# EAGLE design BATT_DCDC_REVISION (EAGLE 9.6.2)
COMPANY: ADAFRUIT INDUSTRIES; DRAWN: KTOWN; REV: B
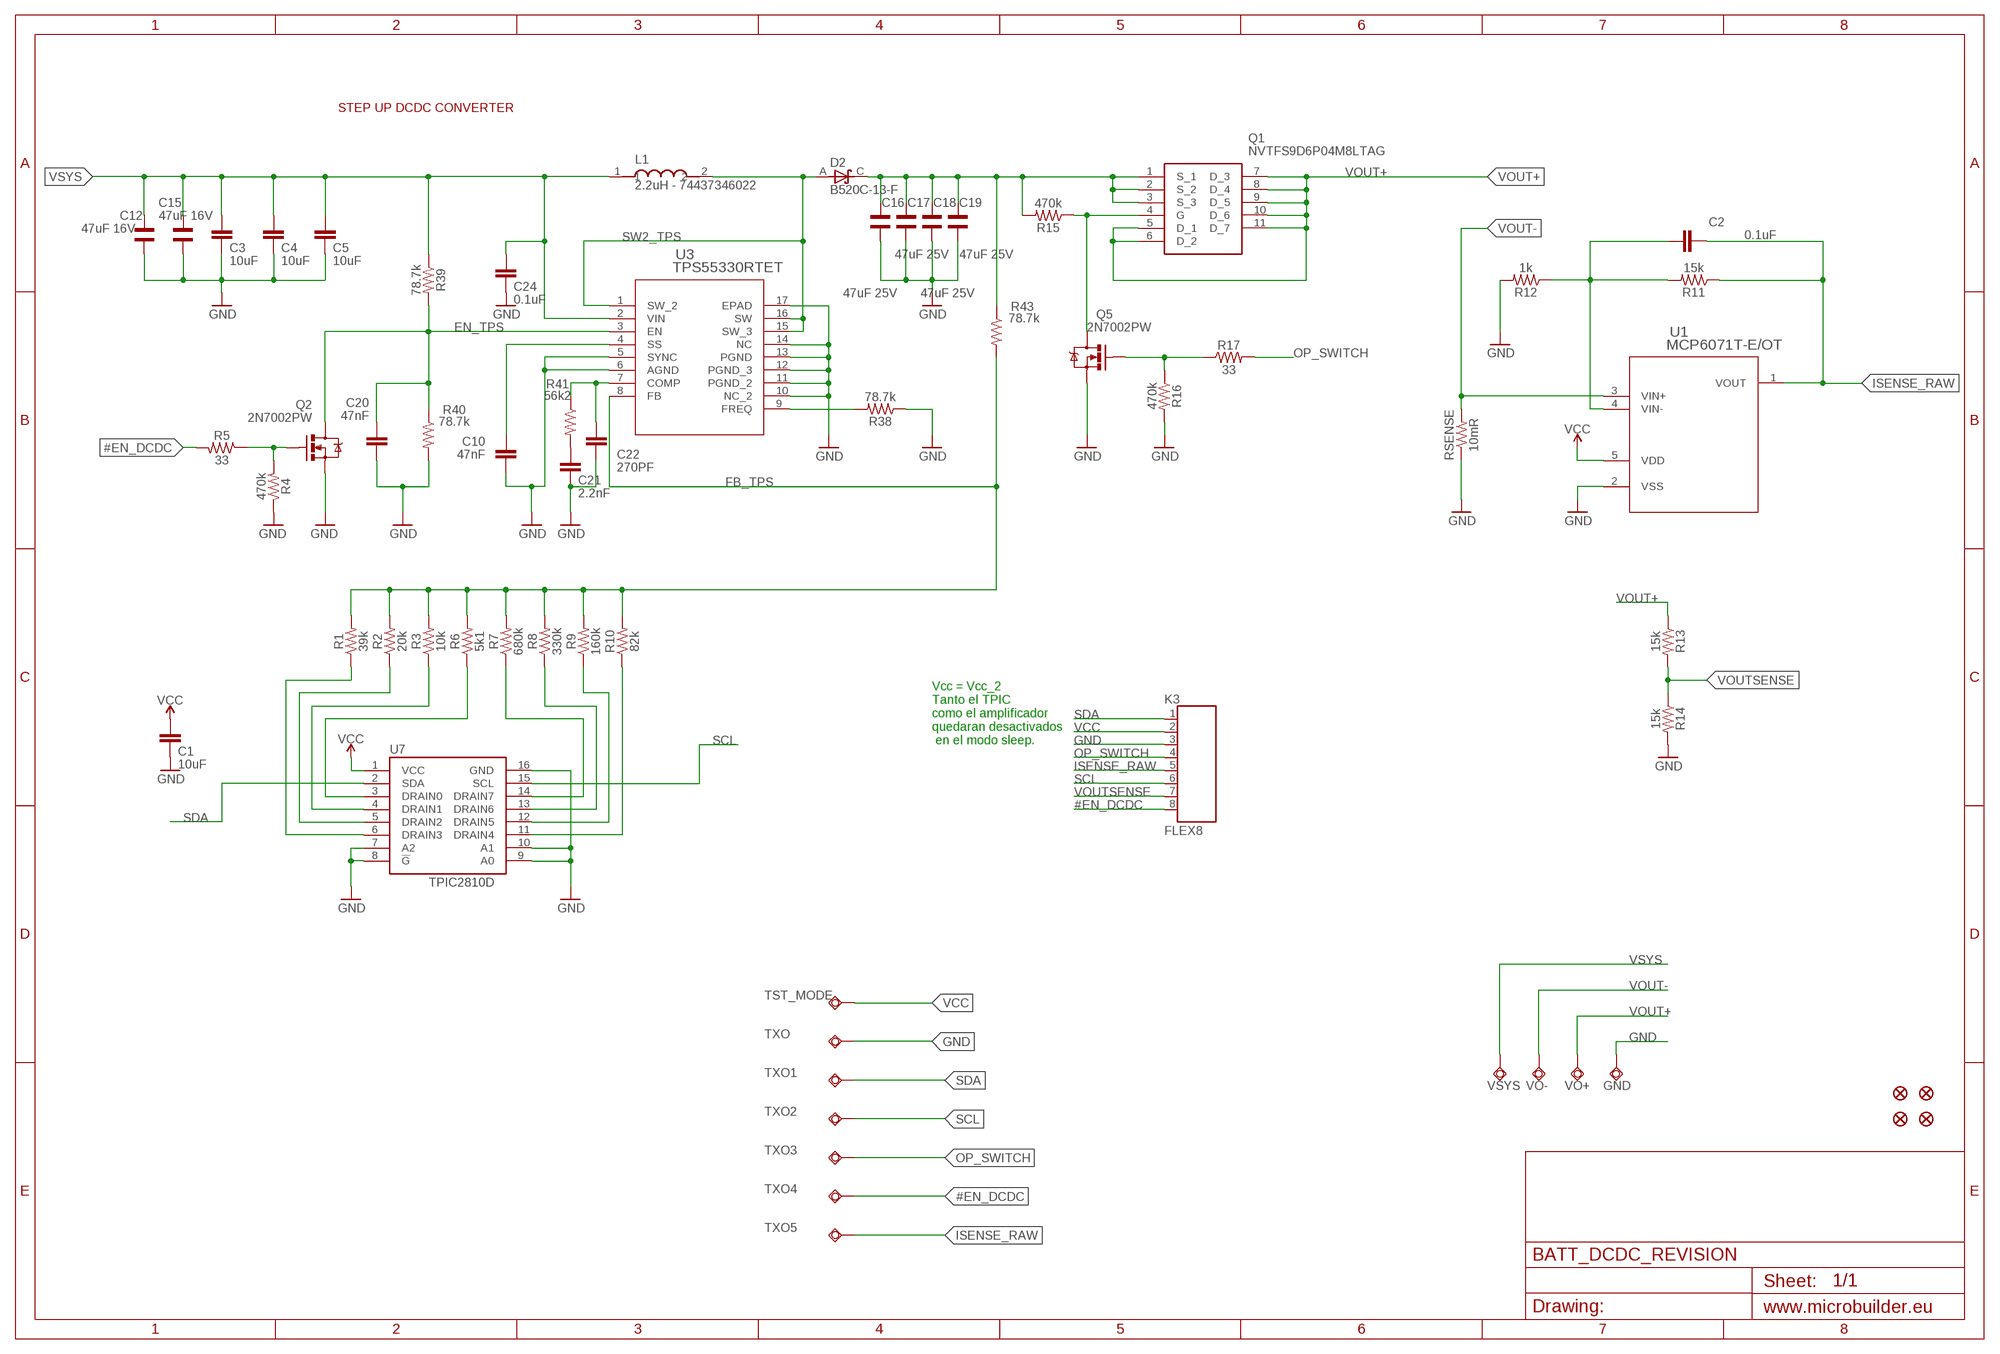
[diagram p0: schematic, sheet 1]

## Parts
C1  10uF  10UF-0805-10V-10%  [0805]
C2  0.1uF  0.1UF-0603-25V-(+80/-20%)  [0603]
C3  10uF  10UF-0805-10V-10%  [0805]
C4  10uF  10UF-0805-10V-10%  [0805]
C5  10uF  10UF-0805-10V-10%  [0805]
C10  47nF  47NF-0603-25V-5%  [0603]
C12  47uF 16V  WCAP-CSGP_1210_885012109003  [WCAP-CSGP_1210]
C15  47uF 16V  WCAP-CSGP_1210_885012109003  [WCAP-CSGP_1210]
C16  47uF 25V  WCAP-CSGP_1210_885012109003  [WCAP-CSGP_1210]
C17  47uF 25V  WCAP-CSGP_1210_885012109003  [WCAP-CSGP_1210]
C18  47uF 25V  WCAP-CSGP_1210_885012109003  [WCAP-CSGP_1210]
C19  47uF 25V  WCAP-CSGP_1210_885012109003  [WCAP-CSGP_1210]
C20  47nF  47NF-0603-25V-5%  [0603]
C21  2.2nF  2.2NF/2200PF-0603-50V-10%  [0603]
C22  270PF  270PF-0603-50V-5%  [0603]
C24  0.1uF  0.1UF-0603-25V-(+80/-20%)  [0603]
D2  B520C-13-F  [DIOM7959X250N]
GND  TESTPAD_TPSQTP15SQ  [TESTPAD_TP15SQ]
K3  FLEX8  [FLEX8]
L1  2.2uH - 74437346022  74437349100  [INDM7366X500]
Q1  NVTFS9D6P04M8LTAG  [NVTFS5124PLTWG]
Q2  2N7002PW  MOSFET-NCHANNEL2N7002PW  [SOT323]
Q5  2N7002PW  MOSFET-NCHANNEL2N7002PW  [SOT323]
R1  39k  RESISTOR0402  [0402]
R2  20k  RESISTOR0402  [0402]
R3  10k  RESISTOR0402  [0402]
R4  470k  RESISTOR0402  [0402]
R5  33  RESISTOR0402  [0402]
R6  5k1  RESISTOR0402  [0402]
R7  680k  RESISTOR0402  [0402]
R8  330k  RESISTOR0402  [0402]
R9  160k  RESISTOR0402  [0402]
R10  82k  RESISTOR0402  [0402]
R11  15k  RESISTOR0402  [0402]
R12  1k  RESISTOR0402  [0402]
R13  15k  RESISTOR0402  [0402]
R14  15k  RESISTOR0402  [0402]
R15  470k  RESISTOR0402  [0402]
R16  470k  RESISTOR0402  [0402]
R17  33  RESISTOR0402  [0402]
R38  78.7k  RESISTOR0402  [0402]
R39  78.7k  RESISTOR0402  [0402]
R40  78.7k  RESISTOR0402  [0402]
R41  56k2  RESISTOR0402  [0402]
R43  78.7k  RESISTOR0402  [0402]
RSENSE  10mR  RESISTOR0603  [0603]
TST_MODE  TESTPAD_TPSQB1,27  [TESTPAD_B1,27]
TXO  TESTPAD_TPSQB1,27  [TESTPAD_B1,27]
TXO1  TESTPAD_TPSQB1,27  [TESTPAD_B1,27]
TXO2  TESTPAD_TPSQB1,27  [TESTPAD_B1,27]
TXO3  TESTPAD_TPSQB1,27  [TESTPAD_B1,27]
TXO4  TESTPAD_TPSQB1,27  [TESTPAD_B1,27]
TXO5  TESTPAD_TPSQB1,27  [TESTPAD_B1,27]
U1  MCP6071T-E/OT  [SOT-23-5_MC_MCH]
U3  TPS55330RTET  [RTE16_1P66X1P66_TEX]
U7  TPIC2810D  [SO16]
U$1  FIDUCIAL""  [FIDUCIAL_1MM]
U$2  FIDUCIAL""  [FIDUCIAL_1MM]
U$34  FIDUCIAL""  [FIDUCIAL_1MM]
U$35  FIDUCIAL""  [FIDUCIAL_1MM]
VO+  TESTPAD_TPSQTP15SQ  [TESTPAD_TP15SQ]
VO-  TESTPAD_TPSQTP15SQ  [TESTPAD_TP15SQ]
VSYS  TESTPAD_TPSQTP15SQ  [TESTPAD_TP15SQ]

## Nets
#EN_DCDC: K3.8 R5.2 TXO4.TP
COMP_TPS: C22.2 R41.1 U3.7(COMP)
EN_TPS: C20.1 Q2.3(D) R39.2 R40.1 U3.3(EN)
FB_TPS: R1.2 R2.2 R3.2 R6.2 R7.2 R8.2 R9.2 R10.2 R43.2 U3.8(FB)
FREQ_TPS: R38.2 U3.9(FREQ)
GND: C1.1 C3.1 C4.1 C5.1 C10.2 C12.1 C15.1 C16.1 C17.1 C18.1 C19.1 C20.2 C21.1 C22.1 C24.1 GND.TP K3.3 Q2.2(S) Q5.2(S) R4.1 R12.2 R14.2 R16.2 R38.1 R40.2 RSENSE.1 TXO.TP U1.2(VSS) U3.5(SYNC) U3.6(AGND) U3.10(NC_2) U3.11(PGND_2) U3.12(PGND_3) U3.13(PGND) U3.14(NC) U3.17(EPAD) U7.7(A2) U7.8(!G) U7.9(A0) U7.10(A1) U7.16(GND)
ISENSE_RAW: C2.1 K3.5 R11.1 TXO5.TP U1.1(VOUT)
N$1: C2.2 R11.2 R12.1 U1.4(VIN-)
N$2: R1.1 U7.6(DRAIN3)
N$3: R2.1 U7.5(DRAIN2)
N$4: Q2.1(G) R4.2 R5.1
N$5: R3.1 U7.4(DRAIN1)
N$6: R6.1 U7.3(DRAIN0)
N$7: R7.1 U7.14(DRAIN7)
N$8: Q1.4(G) Q5.3(D) R15.1
N$9: R8.1 U7.13(DRAIN6)
N$10: R9.1 U7.12(DRAIN5)
N$11: R10.1 U7.11(DRAIN4)
N$13: Q5.1(G) R16.1 R17.1
N$35: C10.1 U3.4(SS)
N$43: C21.2 R41.2
OP_SWITCH: K3.4 R17.2 TXO3.TP
SCL: K3.6 TXO2.TP U7.15(SCL)
SDA: K3.1 TXO1.TP U7.2(SDA)
SW2_TPS: D2.A L1.2 U3.1(SW_2) U3.15(SW_3) U3.16(SW)
VCC: C1.2 K3.2 TST_MODE.TP U1.5(VDD) U7.1(VCC)
VOUT+: Q1.5(D_1) Q1.6(D_2) Q1.7(D_3) Q1.8(D_4) Q1.9(D_5) Q1.10(D_6) Q1.11(D_7) R13.1 VO+.TP
VOUT-: RSENSE.2 U1.3(VIN+) VO-.TP
VOUTSENSE: K3.7 R13.2 R14.1
VSOURCE: C16.2 C17.2 C18.2 C19.2 D2.C Q1.1(S_1) Q1.2(S_2) Q1.3(S_3) R15.2 R43.1
VSYS: C3.2 C4.2 C5.2 C12.2 C15.2 C24.2 L1.1 R39.1 U3.2(VIN) VSYS.TP

## Notes on the sheet
- STEP UP DCDC CONVERTER
- Vcc = Vcc_2
  Tanto el TPIC 
  como el amplificador
  quedaran desactivados
   en el modo sleep.

## Library data of the parts
C1 C3-C5 = SparkFun-Capacitors:10UF: 10.0µF ceramic capacitors A capacitor is a passive two-terminal electrical component used to store electrical energy temporarily in an electric field.; PROD_ID: CAP-11330
C2 C24 = SparkFun-Capacitors:0.1UF: 0.1µF ceramic capacitors A capacitor is a passive two-terminal electrical component used to store electrical energy temporarily in an electric field.; PROD_ID: CAP-00810
C10 C20 = SparkFun-Capacitors:47NF: 47nF ceramic capacitors A capacitor is a passive two-terminal electrical component used to store electrical energy temporarily in an electric field.; PROD_ID: CAP-08605
C12 C15-C19 = Wurth_Elektronik_Passive_Capacitors_rev19a:WCAP-CSGP_1210: WCAP-CSGP Ceramic Capacitors Characteristics Multilayer Ceramic Chip Capacitor Recommended soldering:Reflow, for 0603 and 0805 wave soldering is also allowed Operating temperature:-55 °C to +125 °C; Ceramic characteristics: Class I - NPO ; Class II -X7R, X5R High performance ceramic High capacitance stability Minimal aging Termination:Cu/Ni/Sn <http://katalog.we-online.de/media/images/eisos/WCAP-CSGP_pf2.jpg> Details see: http://katalog.we-online.de/en/pbs/WCAP-CSGP-1210? Created: 2015-01-28 2015 (C) Wurth Elektronik; WE-NUMBER: 885012109003/47uF
C21 = SparkFun-Capacitors:2.2NF/2200PF: 2.2nF/2,200pF ceramic capacitors A capacitor is a passive two-terminal electrical component used to store electrical energy temporarily in an electric field.; PROD_ID: CAP-07877
C22 = SparkFun-Capacitors:270PF: 270pF/0.27nF ceramic capacitors A capacitor is a passive two-terminal electrical component used to store electrical energy temporarily in an electric field.; PROD_ID: CAP-13339
D2 = B520C-13-F:B520C-13-F: 5.0A SURFACE MOUNT SCHOTTKY BARRIER RECTIFIER; AVAILABILITY: Unavailable; DESCRIPTION: Diode Schottky 20V 5A Surface Mount SMC; DIGIKEY-PURCHASE-URL: https://snapeda.com/shop?store=DigiKey&id=325969; MF: Diodes Inc.; MP: B520C-13-F; PACKAGE: DO-214 Diodes Inc.; PRICE: None
GND TST_MODE TXO TXO1-TXO5 VO+ VO- VSYS = BeagleBone_Blue_R3:TESTPAD_TPSQ: Test pad
K3 = Flex_Faja_connector:FLEX8: WR-FPC 1mm SMT Horiz. Bot. Contact Hinge type WR-FPC 1mm 08 pins Hinge type SMT Horizontal Bottom Contact ;=>Code : Con_FPC_ZIF_1.00_6861xx148922_686108148922 <http://katalog.we-online.de/media/images/eican/Con_FPC_ZIF_1.00_686110148922_pf2.jpg> Details see: http://katalog.we-online.de/em/datasheet/6861xx148922.pdf Created 2014-10-08, Karrer Zheng 2014 (C) Wurth Elektronik
L1 = Inductance_2.2uH:74437349100: Inductor, SMD [Würth Elektronik] 74437349100 Inductor, SMD; DESCRIPTION: 10µH Shielded Molded Inductor 3.2A 69mOhm Max Nonstandard; DIGIKEY-PURCHASE-URL: https://snapeda.com/shop?store=DigiKey&id=586788; MF: Wurth Electronics; MP: 74437349100; PACKAGE: Nonstandard Wurth Electronics
Q1 = SamacSys_Parts:NVTFS9D6P04M8LTAG: MOSFET MV8 P INITIAL PROGRAM Source: Datasheet <https://www.onsemi.com/pub/Collateral/NVTFS9D6P04M8L-D.PDF>; DESCRIPTION: MOSFET MV8 P INITIAL PROGRAM; HEIGHT: 0.8mm; MANUFACTURER_NAME: ON Semiconductor; MANUFACTURER_PART_NUMBER: NVTFS9D6P04M8LTAG; MOUSER_PART_NUMBER: 863-NVTFS9D6P04M8LTG; MOUSER_PRICE-STOCK: https://www.mouser.co.uk/ProductDetail/ON-Semiconductor/NVTFS9D6P04M8LTAG/?qs=xZ%2FP%252Ba9zWqYALd8g5rll2Q%3D%3D
Q2 Q5 = SparkFun-DiscreteSemi:MOSFET-NCHANNEL: Common NMOSFET Parts MFG P/N Store ID Prod ID FDD8780 TRANS-09984 SI7820DN TRANS-11055 FDS6630A IC-08089 2N7002PW TRANS-11151 FQP30N06L COM-10213 TRANS-10060 BSS123LT1G TRANS-08345 BSS138 TRANS-00830 BS170 2N7000; PROD_ID: TRANS-11151
R1-R17 R38-R41 R43 RSENSE = SparkFun-Resistors:RESISTOR: Generic Resistor Package
U1 = MCP6071:MCP6071T-E/OT; BUILT_BY: EMA_Jessica; COPYRIGHT: Copyright (C) 2018 Accelerated Designs. All rights reserved; MANUFACTURER_PART_NUMBER: MCP6071T-E/OT; SOURCELIBRARY: Microchip_2019-08-23_21; VENDOR: Microchip
U3 = TPS55330:TPS55330RTET; BUILT_BY: EMA_UL_Team; MANUFACTURER_PART_NUMBER: TPS55330RTET; SOURCELIBRARY: TI_2015-1-5; VENDOR: Texas Instruments
U7 = EDCPSU - Rev2:TPIC2810D
U$1 U$2 U$34 U$35 = microbuilder:FIDUCIAL: Fiducial Alignment Points Various fiducial points for machine vision alignment.; BOM: EXCLUDE

## Net classes
2 gnd: width 0.305 mm, drill 0.483 mm, clearance 0.203 mm

## Board
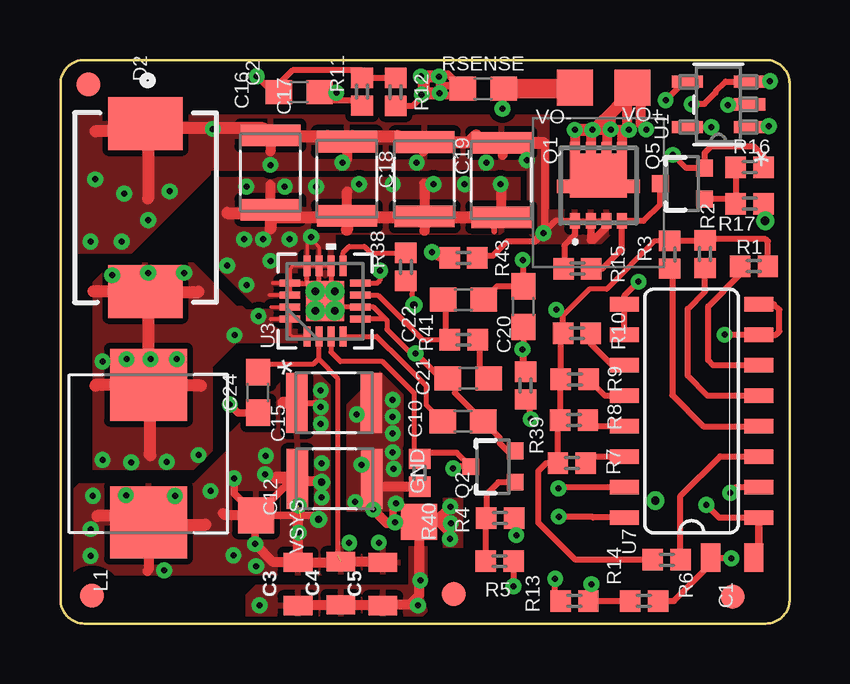
[diagram p1: board, top side]
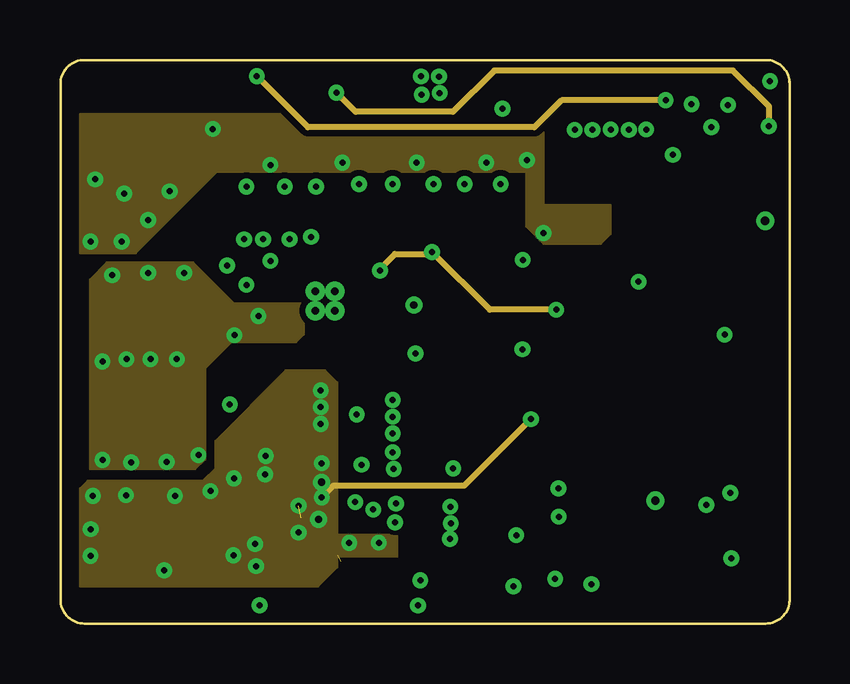
[diagram p2: board, inner layer Route2]
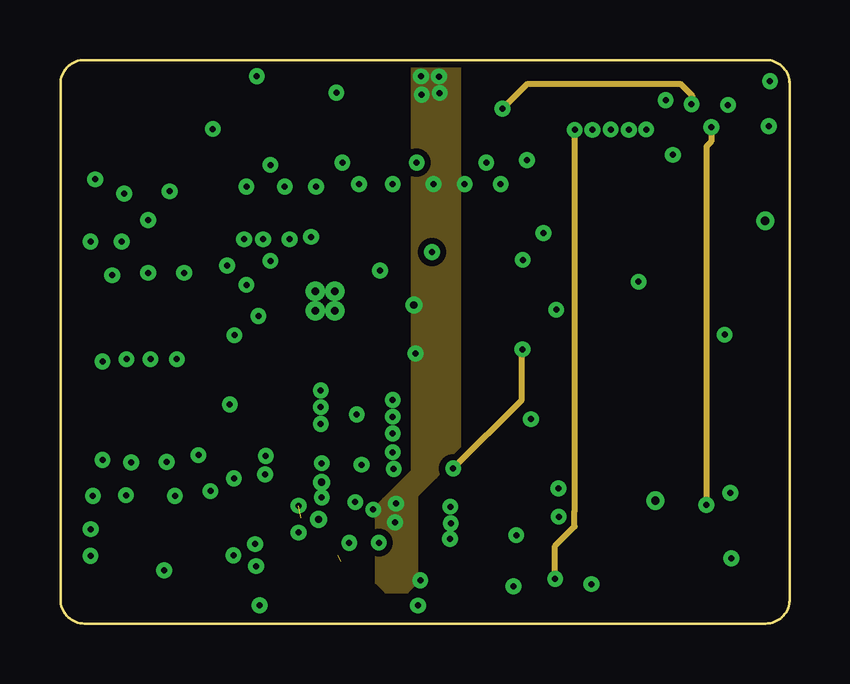
[diagram p3: board, inner layer Route15]
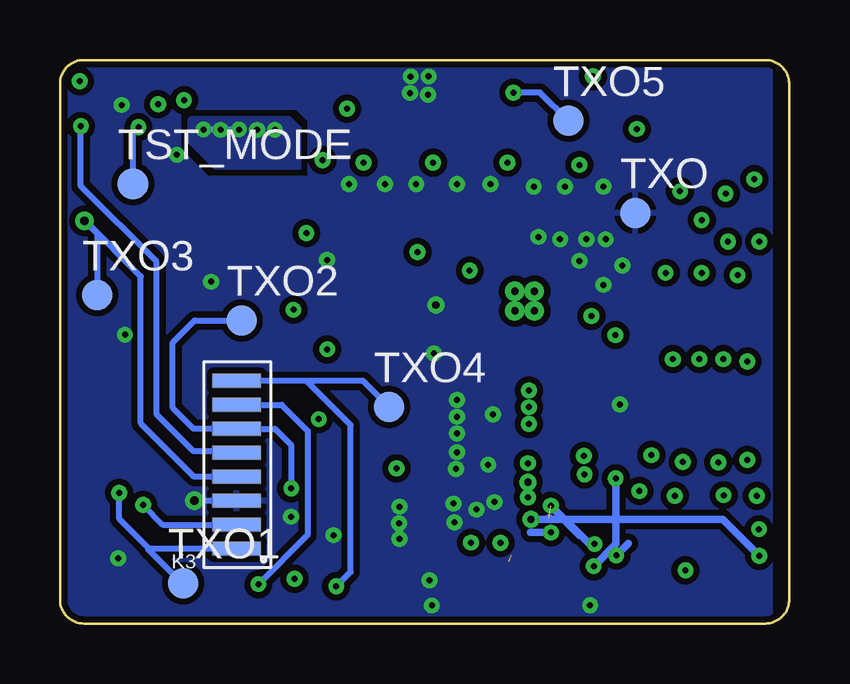
[diagram p4: board, bottom side, seen from below]

Size 30.42 x 23.5 mm. Coordinates in mm from the lower left corner, seen from the top.
Outline: 29.42,0 1.02,0 arc-90 0.02,1 0.02,22.5 arc-90 1.02,23.5 29.42,23.5 arc-90 30.42,22.5 30.42,1 arc-90 29.42,0
Outline: 29.4,23.5 1,23.5 arc90 0,22.5 0,1 arc90 1,0 29.4,0 arc90 30.4,1 30.4,22.5 arc90 29.4,23.5
Copper layers (1+2*15+16): Top 0.035mm / dielectric 1.5mm / Route2 0.035mm / dielectric 0.15mm / Route15 0.035mm / dielectric 0.2mm / Bottom 0.035mm
Design rules "adafruit *": minimum track width 0.15mm, minimum drill 0.25mm, track to track 8mil, track to pad 8mil, pad to pad 8mil, via to via 8mil, smd to smd 8mil, copper to edge 10mil, drill to drill 8mil, minimum pad ring 10mil, minimum via ring 8mil, stop-mask expansion 2mil, vias tented up to drill 20mil, thermal gap 10mil

### Footprints (pad centres in the part's own frame; a part is rotated, then mirrored left to right if it is on the bottom)
0805 = smd 0.8 x 1.2: 1 -0.9,0; 2 0.9,0
0603 = smd 1.1 x 1: 1 -0.85,0; 2 0.85,0
WCAP-CSGP_1210 = smd 0.9 x 2.5: 1 -1.55,0; 2 1.55,0
DIOM7959X250N = smd 2.2 x 3.1: A 3.5,0; C -3.5,0
TESTPAD_TP15SQ = smd 1.5 x 1.5: TP 0,0
FLEX8 = smd 0.6 x 2: 1 -3.5,0.25; 2 -2.5,0.25; 3 -1.5,0.25; 4 -0.5,0.25; 5 0.5,0.25; 6 1.5,0.25; 7 2.5,0.25; 8 3.5,0.25
INDM7366X500 = smd 3 x 3.2: 1 -2.87,0; 2 2.87,0
NVTFS5124PLTWG = smd 0.42 x 0.66: 1 -0.975,-1.47; 2 -0.325,-1.47; 3 0.325,-1.47; 4 0.975,-1.47 | smd 0.42 x 0.47: 5 0.975,1.565; 6 0.325,1.565; 7 -0.325,1.565; 8 -0.975,1.565 | smd 2.37 x 1.83: 9 0,0.415 | smd 0.545 x 0.57: 10 1.458,-0.035; 11 -1.458,-0.035
SOT323 = smd 0.7 x 0.7: 1 -0.65,-0.925; 2 0.65,-0.925; 3 0,0.925
0402 = smd 0.85 x 0.9: 1 -0.58,0; 2 0.58,0
TESTPAD_B1,27 = smd 1.27 x 1.27: TP 0,0
SOT-23-5_MC_MCH = smd 1.31 x 0.508: 1 -1.295,0.95; 2 -1.295,0; 3 -1.295,-0.95; 4 1.295,-0.95; 5 1.295,0.95
RTE16_1P66X1P66_TEX = smd 0.85 x 0.28: 1 -1.475,0.75; 2 -1.475,0.25; 3 -1.475,-0.25; 4 -1.475,-0.75; 9 1.475,-0.75; 10 1.475,-0.25; 11 1.475,0.25; 12 1.475,0.75 | smd 0.28 x 0.85: 5 -0.75,-1.475; 6 -0.25,-1.475; 7 0.25,-1.475; 8 0.75,-1.475; 13 0.75,1.475; 14 0.25,1.475; 15 -0.25,1.475; 16 -0.75,1.475 | smd 1.66 x 1.6: 17 0,0 | drill 0.305 pad 0.508: V -0.406,-0.406; V_1 -0.406,0.406; V_2 0.406,-0.406; V_3 0.406,0.406
SO16 = smd 0.6 x 1.2: 1 -4.445,-2.8; 2 -3.175,-2.8; 3 -1.905,-2.8; 4 -0.635,-2.8; 5 0.635,-2.8; 6 1.905,-2.8; 7 3.175,-2.8; 8 4.445,-2.8; 9 4.445,2.8; 10 3.175,2.8; 11 1.905,2.8; 12 0.635,2.8; 13 -0.635,2.8; 14 -1.905,2.8; 15 -3.175,2.8; 16 -4.445,2.8
FIDUCIAL_1MM = smd 1 x 1: 1 0,0

### Placement (x,y rotation side)
C1  28.02,2.76 0 top
C2  9.97,22.17 180 top
C3  9.92,1.66 90 top
C4  11.71,1.69 90 top
C5  13.46,1.66 90 top
C10  16.8,8.44 0 top
C12  11.45,6.03 180 top
C15  11.43,9.21 180 top
C16  8.77,18.81 90 top
C17  11.96,18.55 90 top
C18  15.2,18.53 90 top
C19  18.4,18.5 90 top
C20  19.32,13.22 90 top
C21  17.02,10.23 0 top
C22  16.82,13.52 180 top
C24  8.26,9.64 90 top
D2  3.56,17.35 270 top
GND  14.97,4.25 270 top
K3  22.8,6.63 90 bottom
L1  3.69,7.09 90 top
Q1  22.45,18.27 0 top
Q2  18.05,6.55 90 top
Q5  25.95,18.35 90 top
R1  28.93,14.91 0 top
R2  26.89,15.41 90 top
R3  25.41,15.39 90 top
R4  18.35,4.41 180 top
R5  18.33,2.61 0 top
R6  25.29,2.67 180 top
R7  21.34,6.7 180 top
R8  21.43,8.49 180 top
R9  21.46,10.19 180 top
R10  21.55,12.11 180 top
R11  12.59,22.18 90 top
R12  13.99,22.17 270 top
R13  21.45,0.95 0 top
R14  24.35,0.95 0 top
R15  21.57,14.8 180 top
R16  28.75,19.03 0 top
R17  28.75,17.51 0 top
R38  14.42,14.88 90 top
R39  19.41,9.93 90 top
R40  14.99,6.29 270 top
R41  16.83,11.84 0 top
R43  16.82,15.25 180 top
RSENSE  17.64,22.3 0 top
TST_MODE  27.38,18.34 0 bottom
TXO  6.43,17.13 0 bottom
TXO1  25.29,1.69 0 bottom
TXO2  22.84,12.65 0 bottom
TXO3  28.86,13.7 0 bottom
TXO4  16.7,9.04 0 bottom
TXO5  9.23,20.97 0 bottom
U1  27.45,21.65 180 top
U3  11.05,13.45 90 top
U7  26.33,8.87 90 top
U$1  28.04,1.13 0 top
U$2  1.18,22.48 0 top
U$34  16.42,1.24 90 top
U$35  1.34,1.17 0 top
VO+  23.86,22.36 270 top
VO-  21.46,22.35 270 top
VSYS  8.17,4.52 270 top

### Tracks (layer width: path | path; a pad name or v marks a point on that pad's centre or on a via)
#EN_DCDC  (via drill 0.25)
  Top 0.254: R5.2 v18.91,1.55
  Bottom 0.254: 20.15,10.13 K3.8 | v18.91,1.55 18.3,2.16 18.3,8.28 20.15,10.13 | TXO4.TP 17.79,10.13 20.15,10.13
COMP_TPS
  Top 0.203: U3.7 13.25,13.7 15.11,11.84 R41.1
  Top 0.254: R41.1 16.08,12.01 16.08,13.41 C22.2
EN_TPS  (via drill 0.25)
  Top 0.2: 14.77,7.69 14.77,8.41
  Top 0.203: U3.3 11.3,11.32 11.69,10.93 13.45,10.93 14.77,9.61 14.77,8.41 | 14.77,7.69 14.77,7.09 R40.1
  Top 0.254: R40.1 15.26,7.14 16.54,7.14 Q2.3 16.51,6.55 16.41,6.45 v16.39,6.47 | v19.28,11.44 19.28,10.64 R39.2 19.32,10.6 C20.1
  Route15 0.254: v16.39,6.47 19.25,9.33 19.25,11.44 v19.28,11.44
FB_TPS  (via drill 0.25)
  Top 0.2: U3.8 13.22,14.2 | 13.22,14.2 | 13.22,14.2 13.34,14.32 v13.34,14.72
  Top 0.203: R3.2 24.81,15.97 22.79,13.95 22.07,13.95 20.97,12.85
  Top 0.254: R3.2 26.87,15.97 R2.2 26.93,16.03 29.42,16.03 29.51,15.94 R1.2 | R6.2 21.48,2.67 19.94,4.21 19.94,6.37 20.27,6.7 R7.2 20.76,8.4 R8.2 20.85,10.16 R9.2 20.88,12.02 R10.2 20.97,12.85 20.73,13.09 v20.69,13.09 | R43.2 15.76,15.25 v15.51,15.5
  Route2 0.254: v20.69,13.09 17.92,13.09 v15.51,15.5 15.43,15.42 13.97,15.42 13.34,14.79 v13.34,14.72
FREQ_TPS
  Top 0.2: 12.06,15.73 12.69,15.73 12.96,15.46 R38.2
  Top 0.203: 12.06,15.73 11.8,15.47 U3.9
GND  (via drill 0.25, 0.3, 0.35)
  Top 0.15: 9.6,14.18 9.6,13.72 U3.14 8.72,13.7 | U3.12 9.73,14.92 9.59,14.79 9.59,14.21 U3.13 8.87,14.2 | U3.12 U3.11 | U3.11 11.28,14.92 U3.10 | U3.12 10.31,14.93 10.31,16.19 10.47,16.03 | 10.47,16.03 v10.47,16.13 | U3.11 10.8,15.7 10.47,16.03
  Top 0.2: U3.6 11.79,13.2 11.8,13.19 11.31,13.19 U3.17 | U3.13 9.6,14.18 10.46,14.18 11.05,13.58 U3.17 | U3.17 10.3,14.2 U3.12 | U3.17 10.8,13.7 U3.11 | U3.17 11.29,13.69 U3.10 | 15.01,11.1 14.8,11.1 13.63,12.27 13.63,12.65 13.48,12.8 | 14.92,4.2 GND.TP 14.97,0.81 v14.92,0.76 | R38.1 14.67,14.05 14.67,13.73
  Top 0.203: 14.67,13.73 14.67,13.28 v14.75,13.28 | U3.5 13.58,12.7 13.48,12.8 13.08,13.2 U3.6
  Top 0.254: U7.10 U7.9 23.53,13.69 v24.11,14.27 v24.12,14.26 | 15.01,11.1 15.88,10.23 C21.1 16.45,10.23 16.46,10.22 16.46,9.63 C10.2 18.33,7.76 18.33,7.53 18.66,7.2 Q2.2 | R4.1 18.93,3.69 v19.02,3.69 | U7.16 22.24,4.42 22.21,4.45 v20.8,4.45 v20.79,4.46 | U7.8 29.77,13.31 29.99,13.09 29.99,12.19 29.85,12.04 U7.7 28,12.04 27.97,12.07 27.73,12.07 v27.71,12.05 | R16.2 29.33,19.51 28.93,19.91 27.15,19.91 26.88,19.63 Q5.2 26.1,19 v25.55,19.55 | v19.29,15.17 19.32,15.14 C20.2 18.22,14.07 C22.1 | U1.2 27.93,21.65 27.9,21.68 v27.85,21.63 | R14.2 25.6,0.95 27.12,2.47 C1.1 27.15,2.73 v27.99,2.73 | C19.1 18.34,16.95 18.1,16.71 18.1,16.36 | R12.2 14.71,21.59 15.08,21.96 v15.08,22.06
  Top 0.305: C24.1 7.43,8.79 v7.08,9.14 | 16.66,22.43 RSENSE.1 16.5,22.01 15.95,22.01 v15.83,22.13 | 16.66,22.43 16.18,22.91 15.14,22.91 v15.05,22.82 15.08,22.79 v15.08,22.06 | v15.8,22.81 15.83,22.78 v15.83,22.13 | v15.83,22.13 15.83,22.28 15.98,22.43 16.66,22.43 | v13.97,4.23 13.89,4.31 13.89,4.89 v14.01,5.01
  Top 0.406: C19.1 18.4,18.15 18.37,18.18 | 15.19,18.35 C18.1 15.2,16.39 15.19,16.38 | C17.1 11.97,18.03 | C16.1 8.77,18.29 | 14.92,4.2 13.62,4.2 v13.06,4.76 | C3.1 9.95,0.79 C4.1 13.43,0.79 | 13.43,0.79 C5.1 | 13.43,0.79 14.57,0.79 14.97,1.19 GND.TP 15.64,4.25 | R40.2 13.57,5.71 | v16.27,4.88 15.64,4.25 | 15.64,4.25 15.79,4.25 16.26,3.78 v16.26,3.54
  Top 0.508: C16.1 8.64,17.13 6.97,17.13 | C16.1 9.08,16.95 C19.1 | C17.1 11.96,16.42 | C16.1 8.77,16.49 | 15.15,22.13 15.15,22.72 v15.05,22.82 v15.06,22.81 v15.8,22.81 | v15.08,22.06 15.15,22.13 | 15.15,22.13 v15.83,22.13
  Bottom 0.254: K3.3 v24.82,5.13
  other vias: 14.83,11.26 12.37,8.73 12.57,6.63 13.91,6.45 13.87,7.15 13.87,7.93 13.87,8.63 13.87,9.33 7.77,14.13 6.97,14.93 7.67,16.03 8.47,16.03 8.77,15.13 9.57,16.03 7.77,18.23 9.37,18.23 10.67,18.23 12.47,18.33 13.87,18.33 15.57,18.33 16.87,18.33 18.37,18.33 8.32,0.77 15.02,1.81 12.31,5.07 16.29,4.18
  pour Top (isolate 0.254): 6.57,18.63 19.17,18.63 19.17,16.23 11.47,16.23 11.47,13.93 10.91,13.37 8.03,13.37 6.57,14.83
  pour Top (isolate 0.254, no thermals): 11.67,4.72 14.27,4.72 14.27,10.03 13.57,10.73 11.67,8.83
  pour Bottom (isolate 0.254, rank 3): 0.75,0.27 29.77,0.27 30.25,0.75 30.25,22.75 29.65,23.35 0.85,23.35 0.75,23.25
  pour Route15 (isolate 0.254): 14.68,23.4 14.68,6.4 13.48,5.2 13.18,4.9 13.18,1.7 13.58,1.3 14.48,1.3 14.88,1.7 14.88,1.8 14.88,5.3 15.68,6.1 16.68,7.1 16.68,7.3 16.68,23.4
  pour Top (isolate 0.254): 15.28,4.16 15.28,0.5 14.88,0.1 7.78,0.1 7.78,1.2 8.18,1.6 14.58,1.6 14.58,3.6
  pour Top (isolate 0.254): 15.98,5.2 15.98,3.2 16.68,3.2 16.78,3.2 16.78,5.2
ISENSE_RAW  (via drill 0.25)
  Top 0.254: v29.55,20.75 28.8,20.75 U1.1 | R11.1 12.59,21.81 11.18,21.81 C2.1 11.49,22.17 v11.52,22.14
  Route2 0.254: v29.55,20.75 29.55,21.57 28.06,23.06 18.11,23.06 16.38,21.34 12.32,21.34 v11.52,22.14
  Bottom 0.254: v29.55,20.75 29.55,18.24 26.4,15.09 26.4,8.73 24.86,7.19 23.11,7.19 K3.5 | TXO5.TP 10.4,22.14 v11.52,22.14
N$1  (via drill 0.25)
  Top 0.254: R12.1 R11.2 12.59,23.07 9.7,23.07 9.12,22.49 C2.2 8.86,22.17 8.76,22.27 v8.21,22.82 | U1.4 25.9,22.59 25.9,22.47 v25.25,21.82
  Route2 0.254: v25.25,21.82 20.91,21.82 19.78,20.69 10.34,20.69 v8.22,22.82 v8.21,22.82
N$2
  Top 0.254: U7.6 27.23,10.77 27.02,10.98 27.02,13.23 28.35,14.56 R1.1
N$3
  Top 0.254: U7.5 27,9.5 26.17,10.33 26.17,13.13 26.89,13.85 R2.1
N$4
  Top 0.254: Q2.1 18.28,5.9 17.77,5.39 R4.2 | R5.1 17.75,4.39
  Top 0.305: 17.75,4.39 R4.2
N$5
  Top 0.254: R3.1 25.52,14.7 25.52,9.53 26.82,8.23 U7.4
N$6
  Top 0.254: R6.1 25.87,5.33 27.52,6.98 29.12,6.98 U7.3
N$7
  Top 0.254: R7.1 22.19,6.96 U7.14
N$8
  Top 0.254: Q5.3 25.03,17.48 24.34,16.8 Q1.4 23.43,15.61 22.61,14.8 R15.1
N$9
  Top 0.254: U7.13 22.27,8.23 R8.1
N$10
  Top 0.254: U7.12 22.73,9.5 R9.1
N$11
  Top 0.254: U7.11 23.03,10.77 22.13,11.67 R10.1
N$13
  Top 0.254: R16.1 R17.1 27.98,17.7 Q5.1
N$35
  Top 0.203: U3.4 13.21,11.97 14.31,10.86 14.31,10.87 15.27,9.91 15.27,9.12 C10.1
N$43
  Top 0.254: C21.2 17.49,10.61 17.49,11.76 R41.2
OP_SWITCH  (via drill 0.35)
  Top 0.254: v29.4,16.8 29.4,17.44 R17.2
  Bottom 0.254: K3.4 24.83,6.13 27.05,8.35 27.05,14.47 29.38,16.8 v29.4,16.8 28.86,16.26 TXO3.TP
SCL  (via drill 0.25)
  Top 0.254: v20.78,5.64 20.84,5.69 U7.15
  Bottom 0.254: v20.78,5.64 20.78,7.45 21.46,8.13 K3.6 24.85,8.13 25.72,9 25.72,11.73 24.8,12.65 TXO2.TP
SDA  (via drill 0.25)
  Top 0.254: v27.95,5.45 28.2,5.69 U7.2
  Bottom 0.254: K3.1 26.7,3.13 | 26.7,3.13 26.76,3.13 25.32,1.69 TXO1.TP | 26.7,3.13 27.95,4.38 v27.95,5.45
SW2_TPS  (via drill 0.25)
  Top 0.15: U3.1 10.28,11.95 9.71,11.95 9.58,12.08 U3.16 | U3.16 U3.15 8.82,13.2 8.81,13.21 | U3.16 8.78,12.7 8.77,12.69
  Top 0.508: D2.A 3.67,13.74 3.67,11.23 3.73,11.29 3.73,7.07 3.77,7.03 | D2.A 3.56,14.22 3.77,14.43 | D2.A 1.4,13.85 | D2.A 3.58,13.83 5.77,13.83 | 1.47,9.93 1.5,9.96 L1.2 3.72,9.93 5.87,9.93
  other vias: 1.77,6.83 1.77,10.93 4.87,11.03 2.17,14.53 5.17,14.63 7.27,12.03 8.27,12.83 5.77,7.03 2.97,6.73 4.45,6.75 2.77,11.03 3.67,14.63 3.77,11.03
  pour Top (isolate 0.254, rank 2): 1.37,6.43 5.57,6.43 6.37,7.23 6.37,10.73 7.37,11.73 10.37,11.73 10.37,13.23 7.37,13.23 5.57,15.03 2.17,15.03 1.37,14.23
  pour Route2 (isolate 0.254, no thermals): 1.25,6.45 5.64,6.45 6.05,6.86 6.05,10.65 7.15,11.75 9.85,11.75 10.15,12.05 10.15,13.35 7.25,13.35 5.55,15.05 1.95,15.05 1.25,14.35
VCC  (via drill 0.25)
  Top 0.254: v26.95,4.95 27.48,4.42 U7.1 | U1.5 v27.15,20.7 | 29.13,2.97 C1.2
  Top 0.305: U7.1 29.13,2.97
  Route15 0.254: v27.15,20.7 27.15,20.1 26.95,19.9 v26.95,4.95
  Bottom 0.254: v26.95,4.95 26.13,4.13 K3.2 | v27.15,20.7 27.38,20.47 TST_MODE.TP
VOUT+  (via drill 0.25)
  Top 0.2: Q1.6 22.78,19.61 22.11,18.95 | Q1.7 22.11,19.82 22.11,18.93
  Top 0.254: Q1.10 Q1.11 21.27,18.23 21.72,18.68 Q1.9 22.36,18.68 22.11,18.93 22.11,18.95 | Q1.8 21.47,19.19 21.79,19.19 22.13,19.52 Q1.7 | Q1.5 23.43,19.44 23.33,19.35 22.13,19.35 22.11,19.37 | R13.1 20.64,1.18 v20.64,1.87
  Top 0.406: v21.46,20.59 v21.47,20.58 Q1.8 | v22.2,20.59 22.14,20.53 22.14,19.85 Q1.7 | v22.96,20.61 22.79,20.44 Q1.6 | v23.72,20.59 23.43,20.3 Q1.5 | v22.2,20.59 22.94,20.59 v22.96,20.61 | v22.96,20.61 23.7,20.61 v23.72,20.59 | v24.44,20.61 24.21,20.84 24.21,21.77 | v23.72,20.59 23.65,20.66 23.65,21.89 23.56,21.8 | VO+.TP 23.56,22.06 23.56,21.8 | v22.96,20.61 22.96,21.2 23.34,21.58 | 23.34,21.58 23.56,21.8 | v22.2,20.59 23.19,21.58 23.34,21.58
  Top 0.508: v21.46,20.59 v22.2,20.59
  Route15 0.254: v20.64,1.87 20.64,3.24 21.45,4.05 21.45,4.7 21.46,4.71 v21.46,20.59
  Bottom 0.254: 23.3,20.59 v23.72,20.59 23.74,20.61 v24.44,20.61
  pour Bottom (isolate 0.2): 20.41,18.96 23.96,18.96 25.05,20.05 25.05,21.05 24.95,21.15 20.85,21.15 20.41,20.71
VOUT-  (via drill 0.25)
  Top 0.254: v29.6,22.62 28.77,22.62 U1.3 27.75,22.6 27.33,22.18 27.33,22.14 26.87,21.68 26.35,21.68 v26.33,21.66 | v18.45,21.47 18.49,21.51 RSENSE.2
  Top 0.61: 21.41,22.3 VO-.TP
  Top 0.813: RSENSE.2 21.41,22.3
  Route15 0.254: v18.45,21.47 19.49,22.51 25.86,22.51 26.36,22.01 26.36,21.69 v26.33,21.66
VOUTSENSE  (via drill 0.25)
  Top 0.254: v22.15,1.65 22.03,1.53 R13.2 R14.1
  Bottom 0.254: K3.7 21.18,9.13 20.09,8.04 20.09,3.71 v22.15,1.65
VSOURCE  (via drill 0.25)
  Top 0.15: Q1.1 Q1.3
  Top 0.203: Q1.1 20.65,16.8 | 20.08,16.23 20.05,16.26
  Top 0.254: 20.65,16.8 19.8,15.95 18.65,15.95 18.04,15.34 17.49,15.34 R43.1 | Q1.1 21.48,16.22 21.02,15.76 21.02,14.83 R15.2 | C19.2 20.21,20.06
  Top 0.305: Q1.2 22.13,16 | 22.13,16 22.11,15.99 | Q1.3 22.78,16.53 22.25,16 22.13,16 | 20.21,20.06 20.21,16.36 19.8,15.95
  Top 0.406: C16.2 8.77,19.69 | C17.2 11.96,19.37 | C18.2 15.15,20.03 15.15,19.69 | C19.2 18.45,20 18.45,19.55
  Top 0.508: C19.2 20.13,20.05 20.14,20.04 | C18.2 17.06,20.08 17.35,20.37 | C17.2 12.19,20.33 14.07,20.33 | 11.17,20.33 8.8,20.33 C16.2 8.47,20.66 3.75,20.66 D2.C | D2.C 3.24,20.53 1.47,20.53 | D2.C 3.67,20.74 3.67,17.73
  other vias: 1.27,15.93 2.57,15.93 3.67,16.83 4.57,18.03 2.67,17.93 1.47,18.53 6.37,20.63 8.77,19.13 11.77,19.23 14.87,19.23 17.77,19.23 19.47,19.33 20.15,16.29
  pour Top (isolate 0.254, rank 2): 0.77,15.43 0.77,21.23 20.39,21.23 20.39,17.27 22.95,17.27 22.95,16.23 22.55,15.83 19.97,15.83 19.17,16.63 19.17,18.83 6.37,18.83 2.97,15.43
  pour Route2 (isolate 0.254, no thermals): 0.85,15.45 3.15,15.45 6.55,18.85 19.45,18.85 19.45,16.55 20.15,15.85 22.55,15.85 22.95,16.25 22.95,17.45 20.15,17.45 20.15,21.25 0.85,21.25
VSYS  (via drill 0.25, 0.3)  (2 unrouted)
  Top 0.203: C24.2 8.26,10.83 10.57,10.83 10.77,11.03 | U3.2 10.77,11.94 10.77,11.03 | 11.59,2.85 11.57,2.87 11.57,10.23 10.77,11.03
  Top 0.254: v19.63,8.53 19.59,8.57 19.59,9.31 19.55,9.35 R39.1 | C15.2 10.69,9.21 v10.87,9.03 | C12.2 10.71,6.03
  Top 0.305: VSYS.TP 7.25,5.44 v7.25,6.06 | VSYS.TP 8.1,4.59 | VSYS.TP 8.02,4.37 | VSYS.TP 8.13,4.48 v8.13,3.32 | v10.91,5.9 9.55,5.9 VSYS.TP | v10.78,4.35 10.61,4.52 VSYS.TP | VSYS.TP 8.54,4.52 | C12.2 9.9,5.24
  Top 0.406: C3.2 11.68,2.56 C4.2 13.43,2.59 C5.2 | 9.9,5.24 9.9,2.58 C3.2 | C3.2 8.89,2.56 v8.13,3.32 | 6.78,4.6 6.86,4.52 VSYS.TP | L1.1 3.69,2.25 3.64,2.2
  Top 0.508: L1.1 3.87,4.4 3.87,5.33 | L1.1 3.42,4.49 1.55,4.49 | L1.1 3.78,4.13 6.07,4.13 | 9.9,9.19 C15.2 9.31,9.22 | C12.2 9.84,6.09 9.01,6.09
  Route2 0.254: v19.63,8.53 16.85,5.75 11.39,5.75 v10.91,5.27
  Bottom 0.152: v9.95,4.92 9.95,4.76 8.8,3.61
  Bottom 0.305: v7.25,6.06 7.25,3.32 v8.17,2.4 | 10.04,4.42 9.99,4.42 | 10.81,3.8 v9.95,3.8 | v8.13,3.32 8.35,3.32 v9.95,4.92 | v10.91,5.9 v10.91,5.27 | v10.78,4.35 2.79,4.35 v1.27,2.83 | 6.73,3.35 v7.23,2.85
  other vias: 8.55,6.22 10.87,8.33 10.87,9.73 1.28,3.94 1.37,5.33 2.75,5.36 4.79,5.33 6.27,5.53 4.34,2.23 10.91,6.69 8.58,7 12.06,3.37 13.29,3.38
  pour Top (isolate 0.254, rank 2): 0.57,2.03 11.17,2.03 11.27,2.13 11.27,9.93 10.77,10.43 9.57,10.43 6.97,7.83 6.97,7.23 5.57,5.83 0.77,5.83 0.57,5.63
  pour Route2 (isolate 0.254, rank 2, no thermals): 0.85,1.55 10.75,1.55 11.55,2.35 11.55,10.05 11.05,10.55 9.4,10.55 6.48,7.63 6.48,6.48 5.95,5.95 1.15,5.95 0.85,5.65
  pour Top (isolate 0.254): 9.08,3.2 9.08,2.1 14.18,2.1 14.18,3.2
  pour Route2: 11.4,3.69 11.4,2.82 11.38,2.8 14.08,2.8 14.08,3.7 11.38,3.7